# Altium schematic sheet ADC.SchDoc
size A4
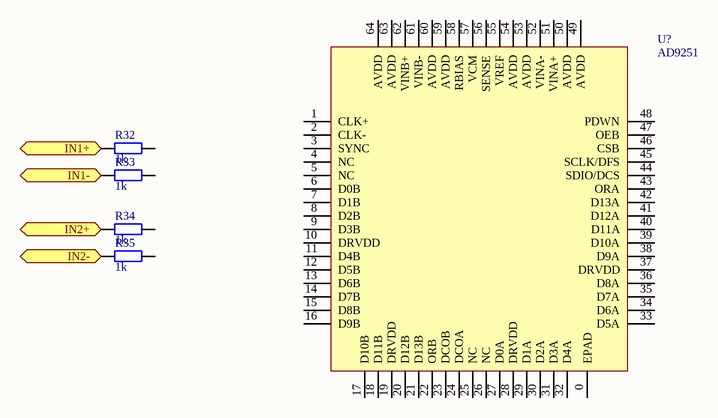
[diagram p0: ADC.SchDoc]

## Parts
R32  1k  [0402]
R33  1k  [0402]
R34  1k  [0402]
R35  1k  [0402]
U?  AD9251  [AD9251]

## Ports
IN1+ (in), IN1- (in), IN2+ (in), IN2- (in)

## Nets
IN1+: R32.2 ; port IN1+
IN1-: R33.2 ; port IN1-
IN2+: R34.2 ; port IN2+
IN2-: R35.2 ; port IN2-

Not connected (* = marked no-connect by the designer): R32 1; R33 1; R34 1; R35 1; U? 0(EPAD) 1(CLK+) 2(CLK-) 3(SYNC) 4(NC) 5(NC) 6(D0B) 7(D1B) 8(D2B) 9(D3B) 10(DRVDD) 11(D4B) 12(D5B) 13(D6B) 14(D7B) 15(D8B) 16(D9B) 17(D10B) 18(D11B) 19(DRVDD) 20(D12B) 21(D13B) 22(ORB) 23(DCOB) 24(DCOA) 25(NC) 26(NC) 27(D0A) 28(DRVDD) 29(D1A) 30(D2A) 31(D3A) 32(D4A) 33(D5A) 34(D6A) 35(D7A) 36(D8A) 37(DRVDD) 38(D9A) 39(D10A) 40(D11A) 41(D12A) 42(D13A) 43(ORA) 44(SDIO/DCS) 45(SCLK/DFS) 46(CSB) 47(OEB) 48(PDWN) 49(AVDD) 50(AVDD) 51(VINA+) 52(VINA-) 53(AVDD) 54(AVDD) 55(VREF) 56(SENSE) 57(VCM) 58(RBIAS) 59(AVDD) 60(AVDD) 61(VINB-) 62(VINB+) 63(AVDD) 64(AVDD)

## Library data of the parts
R32-R35 = Res2: Resistor; Published: 8-Jun-2000; LatestRevisionDate: 17-Jul-2002; LatestRevisionNote: Re-released for DXP Platform.; PackageReference: AXIAL-0.4; Publisher: Altium Limited; PackageDescription: Axial Device, Thru-Hole; 2 Leads; 0.4 in Pin Spacing